# EAGLE schematic cryptoshield (EAGLE 6.5.0)
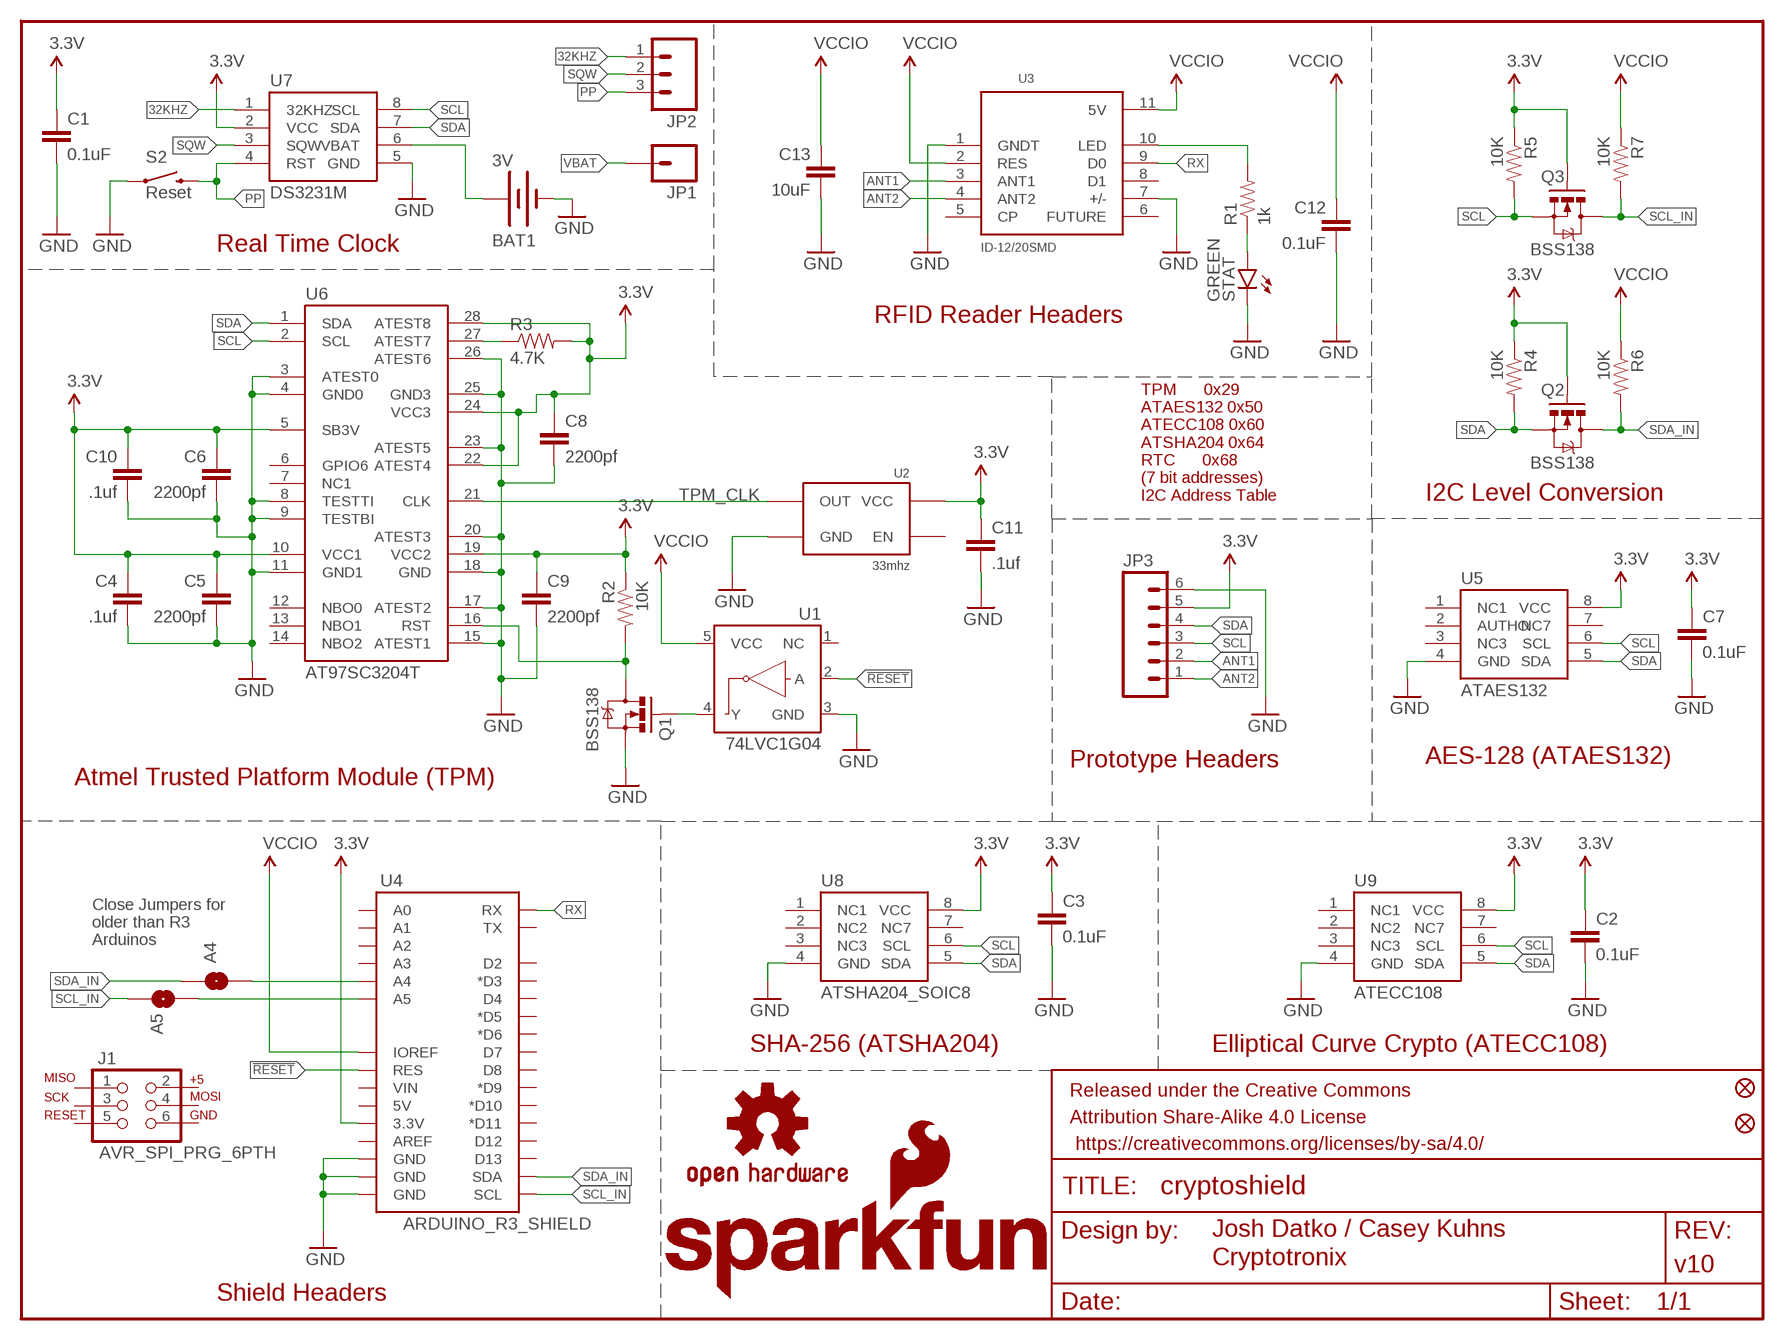
[diagram p0: schematic, sheet 1]

## Parts
A4  JUMPER-PAD-2-NOYES_SILK  [PAD-JUMPER-2-NO_YES_SILK]
A5  JUMPER-PAD-2-NOYES_SILK  [PAD-JUMPER-2-NO_YES_SILK]
BAT1  3V  BATTERY12MM  [BATTCON_12MM]
C1  0.1uF  0.1UF-25V(+80/-20%)(0603)  [0603-CAP]
C2  0.1uF  0.1UF-25V(+80/-20%)(0603)  [0603-CAP]
C3  0.1uF  0.1UF-25V(+80/-20%)(0603)  [0603-CAP]
C4  .1uf  0.1UF-25V(+80/-20%)(0603)  [0603-CAP]
C5  2200pf  2.2NF/2200PF-50V-10%(0603)  [0603-CAP]
C6  2200pf  2.2NF/2200PF-50V-10%(0603)  [0603-CAP]
C7  0.1uF  0.1UF-25V(+80/-20%)(0603)  [0603-CAP]
C8  2200pf  2.2NF/2200PF-50V-10%(0603)  [0603-CAP]
C9  2200pf  2.2NF/2200PF-50V-10%(0603)  [0603-CAP]
C10  .1uf  0.1UF-25V(+80/-20%)(0603)  [0603-CAP]
C11  .1uf  0.1UF-25V(+80/-20%)(0603)  [0603-CAP]
C12  0.1uF  0.1UF-25V(+80/-20%)(0603)  [0603-CAP]
C13  10uF  10UF50V20%(1210)  [1210]
FID1  FIDUCIAL1X2  [FIDUCIAL-1X2]
FID2  FIDUCIAL1X2  [FIDUCIAL-1X2]
FRAME2  FRAME-LETTER  [CREATIVE_COMMONS]
J1  AVR_SPI_PRG_6PTH  [2X3]
JP1  M01PTH  [1X01]
JP2  M03PTH  [1X03]
JP3  M06NO_SILK_FEMALE_PTH  [1X06_NO_SILK]
LOGO2  OSHW-LOGOS  [OSHW-LOGO-S]
LOGO3  SFE_LOGO_NAME_FLAME.1_INCH  [SFE_LOGO_NAME_FLAME_.1]
Q1  BSS138  MOSFET-NCHANNELBSS138  [SOT23-3]
Q2  BSS138  MOSFET-NCHANNELBSS138  [SOT23-3]
Q3  BSS138  MOSFET-NCHANNELBSS138  [SOT23-3]
R1  1k  1K-1%  [0603-RES]
R2  10K  10KOHM-1/10W-1%(0603)0603  [0603-RES]
R3  4.7K  4.7KOHM1/10W1%(0603)  [0603]
R4  10K  10KOHM-1/10W-1%(0603)0603  [0603-RES]
R5  10K  10KOHM-1/10W-1%(0603)0603  [0603-RES]
R6  10K  10KOHM-1/10W-1%(0603)0603  [0603-RES]
R7  10K  10KOHM-1/10W-1%(0603)0603  [0603-RES]
S2  Reset  SWITCH-MOMENTARY-2SMD  [TACTILE-SWITCH-SMD]
STAT  GREEN  LED-GREEN0603  [LED-0603]
U1  74LVC1G04  INVERTER_SOT353-5  [SOT353]
U2  33mhz  33MHZ-OSCILLATOR  [CRYSTAL-OSC-SMD-5X3.2]
U3  ID-12/20SMD  [ID-12_SMD]
U4  ARDUINO_R3_SHIELD  [UNO_R3_SHIELD]
U5  ATAES132  [SOIC8]
U6  AT97SC3204T  [TSSOP28]
U7  DS3231M  [SOIC8]
U8  ATSHA204_SOIC8  [SOIC8]
U9  ATECC108  [SOIC8]

## Nets
3.3V: C1.1 C2.1 C3.1 C4.1 C5.1 C6.1 C7.1 C8.1 C9.1 C10.1 C11.1 JP3.5 Q2.1(G) Q3.1(G) R2.1 R3.2 R4.1 R5.1 U2.4(VCC) U4.3.3V U5.8(VCC) U6.5(SB3V) U6.10(VCC1) U6.19(VCC2) U6.22(ATEST4) U6.24(VCC3) U6.28(ATEST8) U7.2(VCC) U8.8(VCC) U9.8(VCC)
32KHZ: JP2.1 U7.1(32KHZ)
!RESET: U1.2(A) U4.RES
ANT1: JP3.2 U3.3(ANT1)
ANT2: JP3.1 U3.4(ANT2)
GND: BAT1.GND(-) C1.2 C2.2 C3.2 C4.2 C5.2 C6.2 C7.2 C8.2 C9.2 C10.2 C11.2 C12.2 C13.2 JP3.6 Q1.2(S) S2.1 STAT.C U1.3(GND) U2.2(GND) U3.1(GNDT) U3.7(+/-) U4.GND@0(GND) U4.GND@1(GND) U4.GND@2(GND) U5.4(GND) U6.3(ATEST0) U6.4(GND0) U6.8(TESTTI) U6.9(TESTBI) U6.11(GND1) U6.15(ATEST1) U6.17(ATEST2) U6.18(GND) U6.20(ATEST3) U6.23(ATEST5) U6.25(GND3) U6.26(ATEST6) U7.5(GND) U8.4(GND) U9.4(GND)
N$1: R1.2 U3.10(LED)
N$4: A4.2 U4.A4
N$6: A5.2 U4.A5
N$12: R1.1 STAT.A
N$18: Q1.3(D) R2.2 U6.16(RST)
N$19: R3.1 U6.27(ATEST7)
N$20: Q1.1(G) U1.4(Y)
PP: JP2.3 S2.3 U7.4(RST)
RX: U3.9(D0) U4.RX
SCL: JP3.3 Q3.2(S) R5.2 U5.6(SCL) U6.2(SCL) U7.8(SCL) U8.6(SCL) U9.6(SCL)
SCL_IN: A5.1 Q3.3(D) R7.2 U4.SCL
SDA: JP3.4 Q2.2(S) R4.2 U5.5(SDA) U6.1(SDA) U7.7(SDA) U8.5(SDA) U9.5(SDA)
SDA_IN: A4.1 Q2.3(D) R6.2 U4.SDA
SQW: JP2.2 U7.3(SQW)
TPM_CLK: U2.3(OUT) U6.21(CLK)
VBAT: BAT1.PWR@1(+) JP1.1 U7.6(VBAT)
VCCIO: C12.1 C13.1 R6.1 R7.1 U1.5(VCC) U3.2(RES) U3.11(5V) U4.IOREF
Unconnected: J1.1 J1.2 J1.3 J1.4 J1.5 J1.6 U1.1(NC) U2.1(EN) U3.5(CP) U3.6(FUTURE) U3.8(D1) U4.5V U4.A0 U4.A1 U4.A2 U4.A3 U4.AREF U4.D2 U4.D3(*D3) U4.D4 U4.D5(*D5) U4.D6(*D6) U4.D7 U4.D8 U4.D9(*D9) U4.D10(*D10) U4.D11(*D11) U4.D12 U4.D13 U4.TX U4.VIN U5.1(NC1) U5.2(AUTHO) U5.3(NC3) U5.7(NC7) U6.6(GPIO6) U6.7(NC1) U6.12(NBO0) U6.13(NBO1) U6.14(NBO2) U8.1(NC1) U8.2(NC2) U8.3(NC3) U8.7(NC7) U9.1(NC1) U9.2(NC2) U9.3(NC3) U9.7(NC7)

## Notes on the sheet
- Real Time Clock
- RFID Reader Headers
- TPM      0x29
  ATAES132 0x50
  ATECC108 0x60
  ATSHA204 0x64
  RTC      0x68
  (7 bit addresses)
- I2C Address Table | I2C Level Conversion
- Prototype Headers | AES-128 (ATAES132)
- Atmel Trusted Platform Module (TPM)
- Close Jumpers for 
  older than R3
  Arduinos
- SHA-256 (ATSHA204) | Elliptical Curve Crypto (ATECC108)
- Cryptotronix
- Shield Headers

## Library data of the parts
A4 A5 = SparkFun-Passives:JUMPER-PAD-2-NO
BAT1 = SparkFun-Electromechanical:BATTERY: Battery Holders Various common sizes : AA, AAA, 18650 (PRT-12895), 20mm coin cell and 12mm coin cell. 20MM_4LEGS, BATT-10373; PROD_ID: BATT-08044
C1-C3 C7 C12 = SparkFun-Capacitors:0.1UF-25V(+80/-20%)(0603): CAP-00810 Ceramic Standard decoupling cap; PROD_ID: CAP-00810
C4 C10 C11 = SparkFun-Capacitors:0.1UF-25V(+80/-20%)(0603): CAP-00810 Ceramic Standard decoupling cap; PROD_ID: CAP-00810; VALUE: 0.1uF
C5 C6 C8 C9 = SparkFun-Capacitors:2.2NF/2200PF-50V-10%(0603): CAP-07877; PROD_ID: CAP-07877; VALUE: 2.2nF
C13 = SparkFun-Capacitors:10UF50V20%(1210): CAP-09824; PROD_ID: CAP-09824
FID1 FID2 = SparkFun-Aesthetics:FIDUCIAL: Fiducial Alignment Points Various fiducial points for machine vision alignment.
FRAME2 = SparkFun-Aesthetics:FRAME-LETTER: Schematic Frame Standard 8.5x11 US Letter frame; DESIGNER: Josh Datko / Casey Kuhns; VERSION: v10
J1 = SparkFun-Connectors:AVR_SPI_PRG_6: AVR ISP 6 Pin This is the reduced ISP connector for AVR programming. Common on Arduino. This footprint will take up less PCB space and can be used with a 10-pin to 6-pin adapter such as SKU: BOB-08508 **Special note about "TEST_POINT" package. The stop mask is on the top side, so if you want your programming test points to be on the bottom of your board, make sure to place this package on the bottom side of the board. This also ensure that the orientation to program from the bottom side will be correct.
JP1 = SparkFun-Connectors:M01: Header 1 Standard 1-pin 0.1" header. Use with straight break away headers (SKU : PRT-00116), right angle break away headers (PRT-00553), swiss pins (PRT-00743), machine pins (PRT-00117), and female headers (PRT-00115).
JP2 = SparkFun-Connectors:M03: Header 3 Standard 3-pin 0.1" header. Use with straight break away headers (SKU : PRT-00116), right angle break away headers (PRT-00553), swiss pins (PRT-00743), machine pins (PRT-00117), and female headers (PRT-00115). Molex polarized connector foot print use with SKU : PRT-08232 with associated crimp pins and housings.
JP3 = SparkFun-Connectors:M06: Header 6 Standard 6-pin 0.1" header. Use with straight break away headers (SKU : PRT-00116), right angle break away headers (PRT-00553), swiss pins (PRT-00743), machine pins (PRT-00117), and female headers (PRT-00115). Molex polarized connector foot print use with SKU : PRT-08094 with associated crimp pins and housings. NOTES ON THE VARIANTS LOCK and LOCK_LONGPADS... This footprint was designed to help hold the alignment of a through-hole component (i.e. 6-pin header) while soldering it into place. You may notice that each hole has been shifted either up or down by 0.005 of an inch from it's more standard position (which is a perfectly straight line). This slight alteration caused the pins (the squares in the middle) to touch the edges of the holes. Because they are alternating, it causes a "brace" to hold the component in place. 0.005 has proven to be the perfect amount of "off-center" position when using our standard breakaway headers. Although looks a little odd when you look at the bare footprint, once you have a header in there, the alteration is very hard to notice. Also,if you push a header all the way into place, it is covered up entirely on the bottom side. This idea of altering the position of holes to aid alignment will be further integrated into the Sparkfun Library for other footprints. It can help hold any component with 3 or more connection pins.; PROD_ID: CONN-08437
LOGO2 = SparkFun-Aesthetics:OSHW-LOGO: Open Source Hardware Logo This logo indicates the piece of hardware it is found on incorporates a OSHW license and/or adheres to the definition of open source hardware found here: http://freedomdefined.org/OSHW
LOGO3 = SparkFun-Aesthetics:SFE_LOGO_NAME_FLAME: SFE Logo, name and flame This is the SparkFun full logo. The logo on the schematic will always be the same size; the package variant is the height of the flame part of the logo. Default layer for the logo on the board is tSilk.
Q1-Q3 = SparkFun-DiscreteSemi:MOSFET-NCHANNEL: Common NMOSFET Parts MFG P/N Store ID Prod ID FDD8780 TRANS-09984 SI7820DN TRANS-11055 FDS6630A IC-08089 2N7002PW TRANS-11151 FQP30N06L COM-10213 TRANS-10060 BSS123LT1G TRANS-08345 BSS138 TRANS-00830 BS170 2N7000; PROD_ID: TRANS-00830; VALUE: 200mA/50V
R1 = SparkFun-Resistors:1K-1%: 1k-ohm SMT 1/10W - 1% (0603) RES-07856; PROD_ID: RES-07856
R2 R4-R7 = SparkFun-Resistors:10KOHM-1/10W-1%(0603): RES-00824; PROD_ID: RES-00824
R3 = SparkFun-Resistors:4.7KOHM1/10W1%(0603): RES-07857; PROD_ID: RES-07857
S2 = SparkFun-Electromechanical:SWITCH-MOMENTARY-2: Various NO switches- pushbuttons, reed, etc; PROD_ID: SWCH-08247
STAT = SparkFun-LED:LED-GREEN: Various green LEDs Green LEDs used in SFE Production 0603- DIO-00821 LARGE- DIO-00862 LILYPAD- DIO-09910; PROD_ID: DIO-00821
U1 = SparkFun-DigitalIC:INVERTER: Single inverter, SOT23-5; PROD_ID: 10843
U2 = SparkFun-FreqCtrl:33MHZ-OSCILLATOR: Generic 5x3.2 Oscillator; PROD_ID: XTAL-11986
U3 = SparkFun-RF:ID-12/20: RFID reader for ID2, ID12, and ID20 Package
U4 = SparkFun-Boards:ARDUINO_R3_SHIELD: Shield form compatible with the Arduino Uno R3.
U5 = SparkFun-DigitalIC:ATAES132: 32Kb Serial EEPROM. AES-128-CCM. MAC. Secure Storage for 128-bit keys. Encrypted User Memory Readn and Write. HWRNG. 2.5V to 5.5V.; PROD_ID: IC-11983
U6 = SparkFun-DigitalIC:AT97SC3204T: Atmel TPM 1.2; PROD_ID: IC-11984
U7 = SparkFun-DigitalIC:DS3231M: DS3231M Real Time Clock. Accuracy +/-5ppm. Battery Backup. 2.3V to 5.5V.; PROD_ID: IC-11985
U8 = SparkFun-DigitalIC:ATSHA204_SOIC8: ATSHA204; PROD_ID: IC-11981
U9 = SparkFun-DigitalIC:ATECC108: ATECC108: Provides ECDSA with NIST curves P256, B283, and K283. Also, a RNG, 8.5Kb EEPROM. 2.0V - 5.5V.; PROD_ID: IC-11982